# Altium schematic sheet Output.SchDoc
size A4; DateDraw: Date Draw; DateChecked: Date Review; Workspace: Workspace; TitleTyp: Title-Typ; PageSetup: Record=PageOptions|CenterHorizontal=True|CenterVertical=True|PrintScale=0.97|XCorrection=1.00|YCorrection=1.00|PrintKind=0|BorderSize=5000000|LeftOffset=0|BottomOffset=0|Orientation=2|PaperLength=1000|PaperWidth=1000|Scale=100|PaperSource=7|PrintQuality=-3|MediaType=1|DitherType=10|PrintScaleMode=1|PaperKind=A4|PaperIndex=9
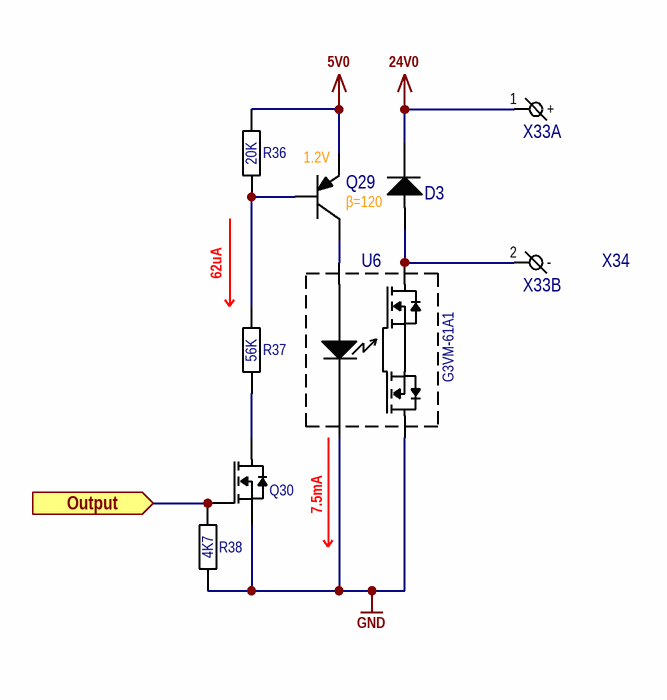
[diagram p0: Output.SchDoc]

## Parts
D3  D  [SOT23-3]  (value not drawn)
Q29  HFE: β=120  [SOT23-3]  (hidden comment: Q)
Q30  Q  [SOT23-3]  (value not drawn)
R36  value 20K  [R0201 Reflow]  (hidden comment: R)
R37  value 56K  [R0603 Reflow]  (hidden comment: R)
R38  value 4K7  [R0402 Reflow]  (hidden comment: R)
U6  U  [4DIP]  (value not drawn)
X33  X  [691322310002]  (value not drawn)  (parts A,B of 2)
X34  X  [691361300002]  (value not drawn)

## Ports
Output (in)

## Nets
5V0: Q29.2(E) R36.2
24V0: D3.3(C) X33.1(+)
GND: Q30.2(S) R38.1 U6.2(C) U6.3(D)
Output: Q30.1(G) R38.2 ; port Output
NetD3_1: D3.1(A) U6.4(D) X33.2(-)
NetQ29_1: Q29.1(B) R36.1 R37.2
NetQ29_3: Q29.3(C) U6.1(A)
NetQ30_3: Q30.3(D) R37.1

## Notes on the sheet
- (near Q29) 1.2V
- 62uA
- 7.5mA
- designed by
- reviewed by
- last drawn by
- Project:
- Schematic:
- last printed
- DIN-A4 L
- sheets
- of
- File:

## Library data of the parts
D3 = HSMS-2800-TR1G: RF DIODE SCHOTTKY 70V SOT23-3; 13. Created Date/Name: AUG 2018 / Hören; ComponentLink1Description: Info; ComponentLink1URL: https://www.digikey.de/products/en/discrete-semiconductor-products/diodes-rf/284?k=HSMS-2800&k=&pkeyword=HSMS-2800&sv=0&pv7=243&sf=0&quantity=&ColumnSort=0&page=1&pageSize=25; ComponentLink2Description: DataSheet; ComponentLink2URL: https://docs.broadcom.com/docs/AV02-0533EN
Q29 = MMSS8550-L-TP: TRANS PNP 25V 1.5A SOT-23; 04. Manufacturer: Micro Commercial Co; 03. Unit Price: 0.17; 13. Created Date/Name: AUG 2018 / Hören; 01. Distributor: DigiKey; 02. Distributor Part Number: MMSS8550-L-TPMSDKR-ND; 07. Manufacturer  Part Number: MMSS8550-L-TP; 09. Operating Temperature: -55°C ~ 150°C (TJ); 11. RoHS: YES; ComponentLink1Description: Info; ComponentLink1URL: https://www.digikey.de/product-detail/en/micro-commercial-co/MMSS8550-L-TP/MMSS8550-L-TPMSDKR-ND/2827206; ComponentLink2Description: DataSheet; ComponentLink2URL: https://www.mccsemi.com/pdf/Products/MMSS8550(SOT-23).pdf; Package: SOT23-3
Q30 = FDV303N: MOSFET N-CH 25V 680MA SOT-23; 04. Manufacturer: ON Semiconductor; 03. Unit Price: 0.41; 13. Created Date/Name: AUG 2018 / Hören; Rds On: 450 mΩ @ id=500mA & Vgs=4.5V; Vgs,th: 1.5V @ 250uA; Power Rating: 350mW; 3D-Export: No; 01. Distributor: DigiKey; 02. Distributor Part Number: FDV303NDKR-ND; 07. Manufacturer  Part Number: FDV303N; 09. Operating Temperature: -55°C ~ 150°C (TJ); 11. RoHS: YES; ComponentLink1Description: Info; ComponentLink1URL: https://www.digikey.de/product-detail/en/on-semiconductor/FDV303N/FDV303NDKR-ND/1630434; ComponentLink2Description: DataSheet; ComponentLink2URL: https://media.digikey.com/pdf/Data%20Sheets/Fairchild%20PDFs/FDV303N.pdf; Vdss: 25V; Id: 680mA
R36 = R: RES SMD 20K OHM 5% 1/10W 0603; 04. Manufacturer: Yageo; 07. Manufacturer  Part Number: RC0603JR-0720KL; 03. Unit Price: 0.09; 13. Created Date/Name: AUG2018/Hören; Power Rating: 0.1W; Tolerance: ±5%; ComponentLink1URL: *; ComponentLink1Description: Info; 02. Distributor Part Number: 311-20KGRDKR-ND; 09. Operating Temperature: -55°C ~ 155°C; 11. RoHS: YES; 01. Distributor: DigiKey; ComponentLink2Description: DataSheet; Type: Thick Film; Package: 0603
R37 = R: RES SMD 56K OHM 5% 1/10W 0603; 04. Manufacturer: Panasonic Electronic Components; 07. Manufacturer  Part Number: ERJ-3GEYJ563V; 03. Unit Price: 0.09; 13. Created Date/Name: AUG2018/Hören; Power Rating: 0.1W; Tolerance: ±5%; ComponentLink1URL: https://www.digikey.de/product-detail/en/panasonic-electronic-components/ERJ-3GEYJ563V/P56KGDKR-ND/577742; ComponentLink1Description: Info; 02. Distributor Part Number: P56KGDKR-ND; 09. Operating Temperature: -55°C ~ 155°C; 11. RoHS: YES; 01. Distributor: DigiKey; ComponentLink2Description: DataSheet; Type: Thick Film; Package: 0603
R38 = R: Resistor; Tolerance: ±1%; 13. Created Date/Name: AUG2018/Hören; ComponentLink1URL: *; ComponentLink1Description: Info; 09. Operating Temperature: -xx..+yy°C; 11. RoHS: ???; ComponentLink2Description: DataSheet; Package: *
U6 = G3VM-61A1: SSR RELAY SPST-NO 500MA 0-60V; 04. Manufacturer: Omron Electronics Inc-EMC Div; 03. Unit Price: 2.26; 13. Created Date/Name: AUG 2018 / Hören; 01. Distributor: DigiKey; 02. Distributor Part Number: Z2100-ND; 07. Manufacturer  Part Number: G3VM-61A1; 11. RoHS: YES; ComponentLink1Description: Info; ComponentLink1URL: https://www.digikey.de/products/en?keywords=G3VM-61A1; ComponentLink2Description: DataSheet; ComponentLink2URL: https://omronfs.omron.com/en_US/ecb/products/pdf/en-g3vm_61a1_d1.pdf; NicName: G3VM-61A1; Package: 4DIP
X33 = 691322310002: TERM BLOCK HDR 2POS 90DEG 3.81MM; 04. Manufacturer: Würth Elektronik; 03. Unit Price: 0.32; 13. Created Date/Name: ??? / Hören; System: Connector; 01. Distributor: DigiKey; 02. Distributor Part Number: 732-2088-ND; 07. Manufacturer  Part Number: 691322310002; 11. RoHS: YES; ComponentLink1Description: Info; ComponentLink1URL: https://www.digikey.de/products/en?keywords=691322310002; ComponentLink2Description: DataSheet; ComponentLink2URL: https://media.digikey.com/pdf/Data%20Sheets/Wurth%20Electronics%20PDFs/Terminal%20Blocks%20WR-TBL.pdf
X34 = 691361300002: TERM BLOCK PLUG 2POS STR 3.81MM; 13. Created Date/Name: ??? / Hören; System: Connector; ComponentLink1Description: Info; ComponentLink1URL: https://www.digikey.de/products/en?keywords=691361300002; ComponentLink2Description: DataSheet; ComponentLink2URL: https://media.digikey.com/pdf/Data%20Sheets/Wurth%20Electronics%20PDFs/Terminal%20Blocks%20WR-TBL.pdf